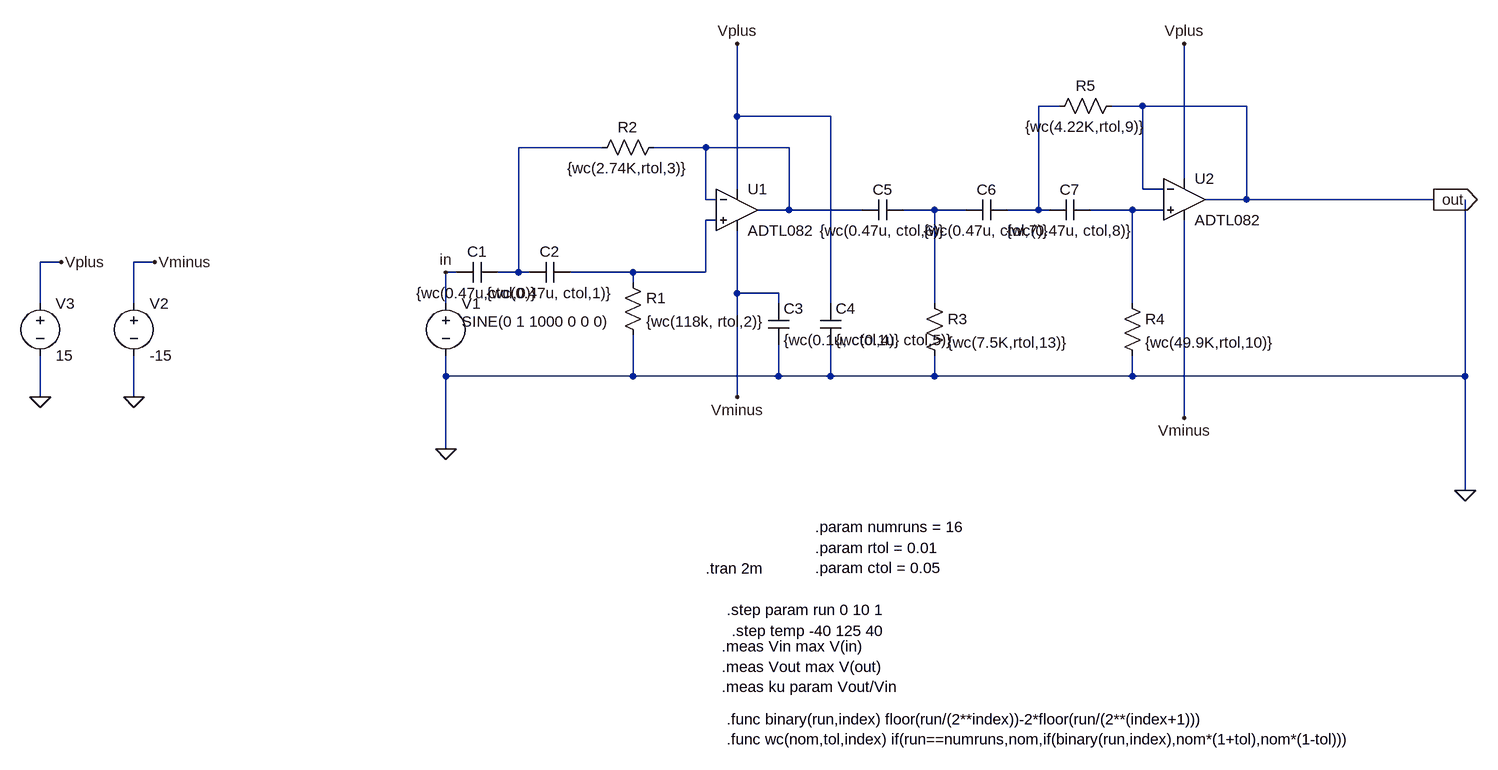
[diagram p0: schematic FINAL Project1.asc]
FINAL Project1.asc, the LTspice schematic file:
Version 4.1
SHEET 1 2264 876
WIRE 1568 -112 1536 -112
WIRE 1696 -112 1648 -112
WIRE 1856 -112 1696 -112
WIRE 1072 -96 1072 -208
WIRE 1216 -96 1072 -96
WIRE 864 -48 736 -48
WIRE 1024 -48 944 -48
WIRE 1152 -48 1024 -48
WIRE 1760 0 1760 -208
WIRE 1072 16 1072 -96
WIRE 1696 16 1696 -112
WIRE 1728 16 1696 16
WIRE 1024 32 1024 -48
WIRE 1040 32 1024 32
WIRE 1856 32 1856 -112
WIRE 1856 32 1792 32
WIRE 2144 32 1856 32
WIRE 1152 48 1152 -48
WIRE 1152 48 1104 48
WIRE 1264 48 1152 48
WIRE 1376 48 1328 48
WIRE 1424 48 1376 48
WIRE 1536 48 1536 -112
WIRE 1536 48 1488 48
WIRE 1552 48 1536 48
WIRE 1680 48 1616 48
WIRE 1728 48 1680 48
WIRE 1040 64 1024 64
WIRE 32 128 0 128
WIRE 176 128 144 128
WIRE 640 144 624 144
WIRE 736 144 736 -48
WIRE 736 144 704 144
WIRE 752 144 736 144
WIRE 912 144 816 144
WIRE 1024 144 1024 64
WIRE 1024 144 912 144
WIRE 912 160 912 144
WIRE 1072 176 1072 80
WIRE 1136 176 1072 176
WIRE 0 192 0 128
WIRE 144 192 144 128
WIRE 624 192 624 144
WIRE 1136 192 1136 176
WIRE 1216 192 1216 -96
WIRE 1376 192 1376 48
WIRE 1680 192 1680 48
WIRE 624 304 624 272
WIRE 912 304 912 240
WIRE 912 304 624 304
WIRE 1136 304 1136 256
WIRE 1136 304 912 304
WIRE 1216 304 1216 256
WIRE 1216 304 1136 304
WIRE 1376 304 1376 272
WIRE 1376 304 1216 304
WIRE 1680 304 1680 272
WIRE 1680 304 1376 304
WIRE 2192 304 2192 32
WIRE 2192 304 1680 304
WIRE 0 336 0 272
WIRE 144 336 144 272
WIRE 1072 336 1072 176
WIRE 1760 368 1760 64
WIRE 624 416 624 304
WIRE 2192 480 2192 304
FLAG 32 128 Vplus
FLAG 176 128 Vminus
FLAG 144 336 0
FLAG 0 336 0
FLAG 1072 -208 Vplus
FLAG 1072 336 Vminus
FLAG 1760 -208 Vplus
FLAG 1760 368 Vminus
FLAG 2144 32 out
IOPIN 2144 32 Out
FLAG 624 416 0
FLAG 2192 480 0
FLAG 624 144 in
SYMBOL cap 704 128 R90
WINDOW 0 0 32 VBottom 2
WINDOW 3 32 32 VTop 2
SYMATTR InstName C1
SYMATTR Value {wc(0.47u,ctol,0)}
SYMBOL cap 816 128 R90
WINDOW 0 0 32 VBottom 2
WINDOW 3 32 32 VTop 2
SYMATTR InstName C2
SYMATTR Value {wc(0.47u, ctol,1)}
SYMBOL res 896 144 R0
SYMATTR InstName R1
SYMATTR Value {wc(118k, rtol,2)}
SYMBOL res 960 -64 R90
WINDOW 0 0 56 VBottom 2
WINDOW 3 32 56 VTop 2
SYMATTR InstName R2
SYMATTR Value {wc(2.74K,rtol,3)}
SYMATTR SpiceLine tol=0.1
SYMBOL OpAmps\\ADTL082 1072 -16 R0
SYMATTR InstName U1
SYMBOL cap 1120 192 R0
SYMATTR InstName C3
SYMATTR Value {wc(0.1u, ctol,4)}
SYMBOL cap 1200 192 R0
SYMATTR InstName C4
SYMATTR Value {wc(0.1u, ctol,5)}
SYMBOL cap 1328 32 R90
WINDOW 0 0 32 VBottom 2
WINDOW 3 32 32 VTop 2
SYMATTR InstName C5
SYMATTR Value {wc(0.47u, ctol,6)}
SYMBOL cap 1488 32 R90
WINDOW 0 0 32 VBottom 2
WINDOW 3 32 32 VTop 2
SYMATTR InstName C6
SYMATTR Value {wc(0.47u, ctol,7)}
SYMBOL res 1360 176 R0
SYMATTR InstName R3
SYMATTR Value {wc(7.5K,rtol,13)}
SYMATTR SpiceLine tol=0.1
SYMBOL cap 1616 32 R90
WINDOW 0 0 32 VBottom 2
WINDOW 3 32 32 VTop 2
SYMATTR InstName C7
SYMATTR Value {wc(0.47u, ctol,8)}
SYMBOL OpAmps\\ADTL082 1760 -32 R0
SYMATTR InstName U2
SYMBOL res 1664 176 R0
SYMATTR InstName R4
SYMATTR Value {wc(49.9K,rtol,10)}
SYMATTR SpiceLine tol=0.1
SYMBOL res 1664 -128 R90
WINDOW 0 0 56 VBottom 2
WINDOW 3 32 56 VTop 2
SYMATTR InstName R5
SYMATTR Value {wc(4.22K,rtol,9)}
SYMATTR SpiceLine tol=0.1
SYMBOL voltage 144 176 R0
WINDOW 123 0 0 Left 0
WINDOW 39 0 0 Left 0
SYMATTR InstName V2
SYMATTR Value -15
SYMBOL voltage 0 176 R0
WINDOW 123 0 0 Left 0
WINDOW 39 0 0 Left 0
SYMATTR InstName V3
SYMATTR Value 15
SYMBOL voltage 624 176 R0
WINDOW 3 24 44 Left 2
WINDOW 39 0 0 Left 0
SYMATTR Value SINE(0 1 1000 0 0 0)
SYMATTR Value2 AC 10
SYMATTR InstName V1
TEXT 1024 600 Left 2 !.tran 2m
TEXT 1048 720 Left 2 !.meas Vin max V(in)\n.meas Vout max V(out)\n.meas ku param Vout/Vin
TEXT 1056 664 Left 2 !.step param run 0 10 1
TEXT 1064 696 Left 2 !.step temp -40 125 40
TEXT 1192 568 Left 2 !.param rtol = 0.01\n.param ctol = 0.05
TEXT 1192 536 Left 2 !.param numruns = 16
TEXT 1056 832 Left 2 !.func binary(run,index) floor(run/(2**index))-2*floor(run/(2**(index+1)))\n.func wc(nom,tol,index) if(run==numruns,nom,if(binary(run,index),nom*(1+tol),nom*(1-tol)))

The netlist it stands for:
* FINAL Project1.asc
C1 N002 in {wc(0.47u,ctol,0)}
C2 N006 N002 {wc(0.47u, ctol,1)}
R1 N006 0 {wc(118k, rtol,2)}
R2 N003 N002 {wc(2.74K,rtol,3)} tol=0.1
X§U1 N006 N003 Vplus Vminus N003 ADTL082  ; pins In+ In- V+ V- OUT
C3 Vminus 0 {wc(0.1u, ctol,4)}
C4 Vplus 0 {wc(0.1u, ctol,5)}
C5 N004 N003 {wc(0.47u, ctol,6)}
C6 N001 N004 {wc(0.47u, ctol,7)}
R3 N004 0 {wc(7.5K,rtol,13)} tol=0.1
C7 N005 N001 {wc(0.47u, ctol,8)}
X§U2 N005 out Vplus Vminus out ADTL082  ; pins In+ In- V+ V- OUT
R4 N005 0 {wc(49.9K,rtol,10)} tol=0.1
R5 out N001 {wc(4.22K,rtol,9)} tol=0.1
V2 Vminus 0 -15
V3 Vplus 0 15
V1 in 0 SINE(0 1 1000 0 0 0) AC 10
.tran 2m
.meas Vin max V(in)
.meas Vout max V(out)
.meas ku param Vout/Vin
.step param run 0 10 1
.step temp -40 125 40
.param rtol = 0.01
.param ctol = 0.05
.param numruns = 16
.func binary(run,index) floor(run/(2**index))-2*floor(run/(2**(index+1)))
.func wc(nom,tol,index) if(run==numruns,nom,if(binary(run,index),nom*(1+tol),nom*(1-tol)))
.lib ADI.lib
.backanno
.end